# EAGLE design poe-light (EAGLE 6.5.0)
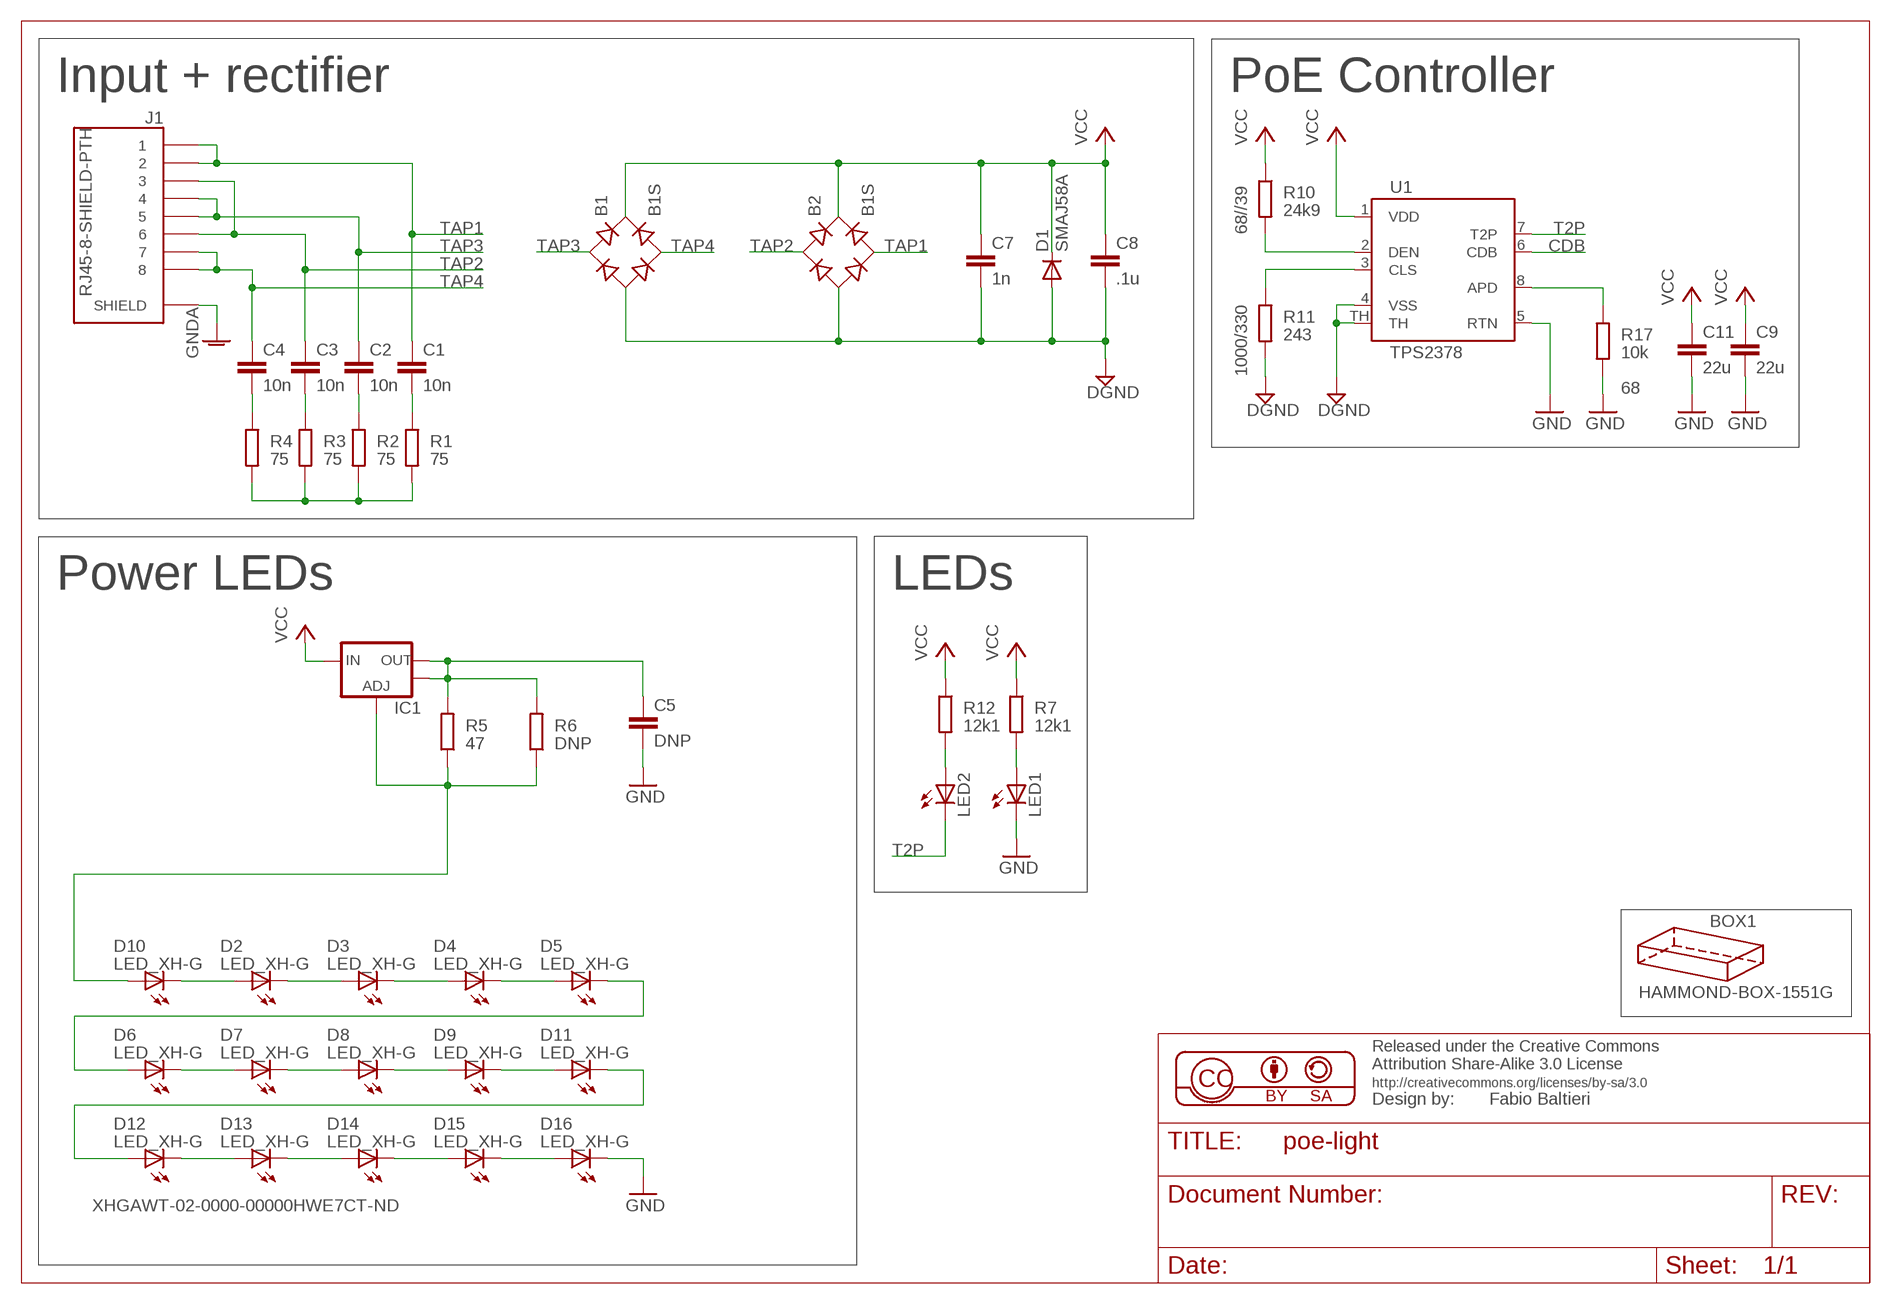
[diagram p0: schematic, sheet 1]

## Parts
B1  B1S  [MBS]
B2  B1S  [MBS]
BOX1  HAMMOND-BOX-1551G  [1551G]
C1  10n  C-EUC0603  [C0603]
C2  10n  C-EUC0603  [C0603]
C3  10n  C-EUC0603  [C0603]
C4  10n  C-EUC0603  [C0603]
C5  DNP  C-EUC0805  [C0805]
C7  1n  C-EUC0603  [C0603]
C8  .1u  C-EUC0603  [C0603]
C9  22u  C-EUC1206  [C1206]
C11  22u  C-EUC1206  [C1206]
D1  SMAJ58A  DIODESMA  [SMA-DIODE]
D2  LED_XH-G  [CREE_XHG]
D3  LED_XH-G  [CREE_XHG]
D4  LED_XH-G  [CREE_XHG]
D5  LED_XH-G  [CREE_XHG]
D6  LED_XH-G  [CREE_XHG]
D7  LED_XH-G  [CREE_XHG]
D8  LED_XH-G  [CREE_XHG]
D9  LED_XH-G  [CREE_XHG]
D10  LED_XH-G  [CREE_XHG]
D11  LED_XH-G  [CREE_XHG]
D12  LED_XH-G  [CREE_XHG]
D13  LED_XH-G  [CREE_XHG]
D14  LED_XH-G  [CREE_XHG]
D15  LED_XH-G  [CREE_XHG]
D16  LED_XH-G  [CREE_XHG]
IC1  V_REG_LM1117SOT223  [SOT223]
J1  RJ45-8-SHIELD-PTH  [RJ45-8-SHIELD]
LED1  LEDSML0805  [SML0805]
LED2  LEDSML0805  [SML0805]
R1  75  R-EU_R0603  [R0603]
R2  75  R-EU_R0603  [R0603]
R3  75  R-EU_R0603  [R0603]
R4  75  R-EU_R0603  [R0603]
R5  47  R-EU_R1206  [R1206]
R6  DNP  R-EU_R1206  [R1206]
R7  12k1  R-EU_R0603  [R0603]
R10  24k9  R-EU_R0603  [R0603]
R11  243  R-EU_R0603  [R0603]
R12  12k1  R-EU_R0603  [R0603]
R17  10k  R-EU_R0603  [R0603]
U1  TPS2378  [SOIC8-POWERPAD]

## Nets
CDB: U1.6(CDB)
DGND: B1.- B2.- C7.2 C8.2 D1.A R11.2 U1.4(VSS) U1.TH
GND: C5.2 C9.2 C11.2 D16.C D16.C@1(C) LED1.C R17.2 U1.5(RTN)
GNDA: J1.P$1(SHIELD) J1.P$2(SHIELD)
N$1: LED1.A R7.2
N$2: LED2.A R12.2
N$3: R10.2 U1.2(DEN)
N$4: R11.1 U1.3(CLS)
N$5: C5.1 IC1.2(OUT) IC1.4(OUT) R5.2 R6.2
N$6: D10.A D10.A@1(A) IC1.1(ADJ) R5.1 R6.1
N$8: D5.C D5.C@1(C) D6.A D6.A@1(A)
N$9: D11.C D11.C@1(C) D12.A D12.A@1(A)
N$10: D2.A D2.A@1(A) D10.C D10.C@1(C)
N$11: D2.C D2.C@1(C) D3.A D3.A@1(A)
N$12: D3.C D3.C@1(C) D4.A D4.A@1(A)
N$13: C4.2 R4.1
N$14: C3.2 R3.1
N$15: C2.2 R2.1
N$16: C1.2 R1.1
N$17: R1.2 R2.2 R3.2 R4.2
N$18: D4.C D4.C@1(C) D5.A D5.A@1(A)
N$19: D6.C D6.C@1(C) D7.A D7.A@1(A)
N$20: D7.C D7.C@1(C) D8.A D8.A@1(A)
N$21: D8.C D8.C@1(C) D9.A D9.A@1(A)
N$22: D9.C D9.C@1(C) D11.A D11.A@1(A)
N$23: D12.C D12.C@1(C) D13.A D13.A@1(A)
N$24: D13.C D13.C@1(C) D14.A D14.A@1(A)
N$25: D14.C D14.C@1(C) D15.A D15.A@1(A)
N$26: D15.C D15.C@1(C) D16.A D16.A@1(A)
N$34: R17.1 U1.8(APD)
T2P: LED2.C U1.7(T2P)
TAP1: B2.AC2 C1.1 J1.1 J1.2
TAP2: B2.AC1 C3.1 J1.3 J1.6
TAP3: B1.AC1 C2.1 J1.4 J1.5
TAP4: B1.AC2 C4.1 J1.7 J1.8
VCC: B1.+ B2.+ C7.1 C8.1 C9.1 C11.1 D1.C IC1.3(IN) R7.1 R10.1 R12.1 U1.1(VDD)

## Notes on the sheet
- Input + rectifier | PoE Controller
- 68//39
- 1000/330
- 68
- Power LEDs | LEDs
- XHGAWT-02-0000-00000HWE7CT-ND

## Library data of the parts
B1 B2 = rectifier:B*S: Surface Mount Glass Passivated Bridge Rectifiers Source: Comchip Bridge Rectifiers B05S-G_B10S-G.pdf
BOX1 = hammond:HAMMOND-BOX: Hammond Project boxes Hammond 1551 Transluscent Blue 50x35x20mm 1551GTBU http://www.hammondmfg.com/pdf/1551G.pdf Hammond 1551 Transluscent Blue 50x50x20mm 1551RTBU http://www.hammondmfg.com/pdf/1551R.pdf Hammond 1551 Transluscent Blue 60x35x20mm 1551HTBU http://www.hammondmfg.com/pdf/1551H.pdf Hammond 1551 Transluscent Blue 80x40x20mm 1551KTBU http://www.hammondmfg.com/pdf/1551K.pdf Hammond 1591 Transluscent Blue 100x51x22m m 1591XXATBU http://www.hammondmfg.com/pdf/1591XXA.pdf
C1-C5 C7-C9 C11 = rcl:C-EU: CAPACITOR, European symbol
D1 = SparkFun-DiscreteSemi:DIODE: Diode These are standard reverse protection diodes and small signal diodes. SMA package can handle up to about 1A. SOD-323 can handle about 200mA. What the SOD-323 package when ordering, there are some mfgs out there that are 5-pin packages.
D2-D16 = balto:LED_XH-G: Cree XLamp XG-H LEDs
IC1 = SparkFun-PowerIC:V_REG_LM1117: Voltage Regulator LM1117 Standard adjustable voltage regulator but in SMD form. Spark Fun Electronics SKU : COM-00595
J1 = balto:RJ45-8-SHIELD
LED1 LED2 = led:LED: LED OSRAM: - CHIPLED LG R971, LG N971, LY N971, LG Q971, LY Q971, LO R971, LY R971 LH N974, LH R974 LS Q976, LO Q976, LY Q976 LO Q996 - Hyper CHIPLED LW Q18S LB Q993, LB Q99A, LB R99A - SideLED LS A670, LO A670, LY A670, LG A670, LP A670 LB A673, LV A673, LT A673, LW A673 LH A674 LY A675 LS A676, LA A676, LO A676, LY A676, LW A676 LS A679, LY A679, LG A679 - Hyper Micro SIDELED® LS Y876, LA Y876, LO Y876, LY Y876 LT Y87S - SmartLED LW L88C, LW L88S LB L89C, LB L89S, LG L890 LS L89K, LO L89K, LY L89K LS L896, LA L896, LO L896, LY L896 - TOPLED LS T670, LO T670, LY T670, LG T670, LP T670 LSG T670, LSP T670, LSY T670, LOP T670, LYG T670 LG T671, LOG T671, LSG T671 LB T673, LV T673, LT T673, LW T673 LH T674 LS T676, LA T676, LO T676, LY T676, LB T676, LH T676, LSB T676, LW T676 LB T67C, LV T67C, LT T67C, LS T67K, LO T67K, LY T67K, LW E67C LS E67B, LA E67B, LO E67B, LY E67B, LB E67C, LV E67C, LT E67C LW T67C LS T679, LY T679, LG T679 LS T770, LO T770, LY T770, LG T770, LP T770 LB T773, LV T773, LT T773, LW T773 LH T774 LS E675, LA E675, LY E675, LS T675 LS T776, LA T776, LO T776, LY T776, LB T776 LHGB T686 LT T68C, LB T68C - Hyper Mini TOPLED® LB M676 - Mini TOPLED Santana® LG M470 LS M47K, LO M47K, LY M47K Source: http://www.osram.convergy.de LUXEON: - LUMILED® LXK2-PW12-R00, LXK2-PW12-S00, LXK2-PW14-U00, LXK2-PW14-V00 LXK2-PM12-R00, LXK2-PM12-S00, LXK2-PM14-U00 LXK2-PE12-Q00, LXK2-PE12-R00, LXK2-PE12-S00, LXK2-PE14-T00, LXK2-PE14-U00 LXK2-PB12-K00, LXK2-PB12-L00, LXK2-PB12-M00, LXK2-PB14-N00, LXK2-PB14-P00, LXK2-PB14-Q00 LXK2-PR12-L00, LXK2-PR12-M00, LXK2-PR14-Q00, LXK2-PR14-R00 LXK2-PD12-Q00, LXK2-PD12-R00, LXK2-PD12-S00 LXK2-PH12-R00, LXK2-PH12-S00 LXK2-PL12-P00, LXK2-PL12-Q00, LXK2-PL12-R00 Source: www.luxeon.com KINGBRIGHT: KA-3528ASYC Source: www.kingbright.com
R1-R7 R10-R12 R17 = rcl:R-EU_: RESISTOR, European symbol
U1 = balto:TPS2378: IEEE 802.3at PoE High-Power PD Interface

## Board
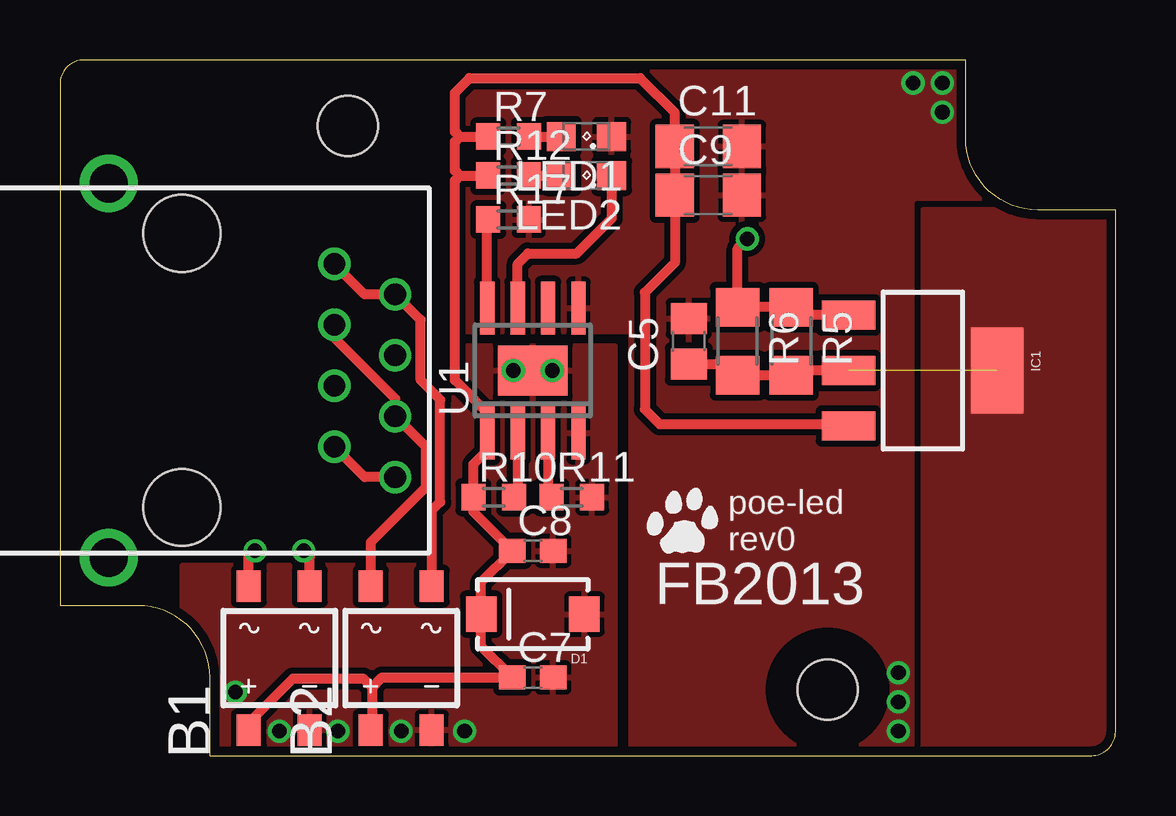
[diagram p1: board, top side]
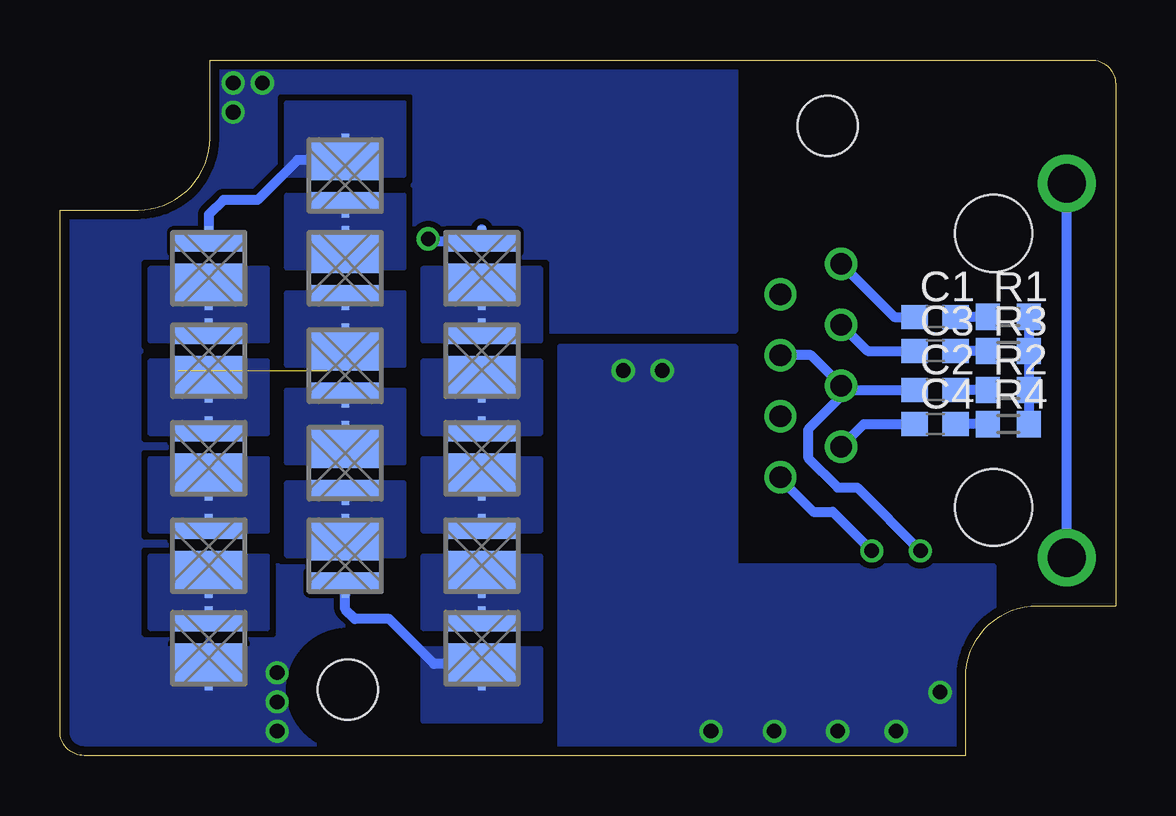
[diagram p2: board, bottom side, seen from below]

Size 44 x 29 mm. Coordinates in mm from the lower left corner, seen from the top.
Copper layers (1*16): Top 0.035mm / dielectric 1.5mm / Bottom 0.035mm
Design rules "balto *": minimum track width 6mil, minimum drill 13mil, track to track 6mil, track to pad 6mil, pad to pad 6mil, via to via 6mil, smd to smd 6mil, copper to edge 15mil, drill to drill 6mil, minimum pad ring 7mil, minimum via ring 7mil, stop-mask expansion 2mil, vias tented up to drill 24mil, thermal gap 8mil

### Footprints (pad centres in the part's own frame; a part is rotated, then mirrored left to right if it is on the bottom)
MBS = smd 1 x 1.3: + -1.27,-3; - 1.27,-3; AC1 -1.27,3; AC2 1.27,3
1551G = hole 2.5: 32,2.75; 12,26.25
C0603 = smd 1.1 x 1: 1 -0.85,0; 2 0.85,0
C0805 = smd 1.3 x 1.5: 1 -0.95,0; 2 0.95,0
C1206 = smd 1.6 x 1.8: 1 -1.4,0; 2 1.4,0
SMA-DIODE = smd 1.27 x 1.47: A -2.15,0; C 2.15,0
CREE_XHG = smd 0.8 x 3: A 1.1,0 | smd 0.25 x 0.33: A@1 1.625,0; C@1 -1.625,0 | smd 1.7 x 3: C -0.65,0
SOT223 = smd 1.219 x 2.235: 1 -2.311,-3.099; 2 0,-3.099; 3 2.311,-3.099 | smd 3.6 x 2.2: 4 0,3.099
RJ45-8-SHIELD = drill 0.9: 1 -4.445,6.35; 2 -3.175,8.89; 3 -1.905,6.35; 4 -0.635,8.89; 5 0.635,6.35; 6 1.905,8.89; 7 3.175,6.35; 8 4.445,8.89 | drill 1.6: P$1 7.795,-3.05; P$2 -7.795,-3.05 | hole 3.2: -5.715,0; 5.715,0
SML0805 = smd 1.2 x 1.2: A 1.05,0; C -1.05,0
R0603 = smd 1 x 1.1: 1 -0.85,0; 2 0.85,0
R1206 = smd 1.6 x 1.803: 1 -1.422,0; 2 1.422,0
SOIC8-POWERPAD = smd 0.6 x 2.2: 1 -1.905,-2.6; 2 -0.635,-2.6; 3 0.635,-2.6; 4 1.905,-2.6; 5 1.905,2.6; 6 0.635,2.6; 7 -0.635,2.6; 8 -1.905,2.6 | smd 2.9 x 2.1: TH 0,0

### Placement (x,y rotation side)
B1  9.14,4.06 0 top
B2  14.22,4.06 0 top
BOX1  0,0 0 top
C1  7.52,18.29 0 bottom
C2  7.52,15.24 0 bottom
C3  7.52,16.87 0 bottom
C4  7.52,13.82 0 bottom
C5  26.21,17.27 90 top
C7  19.71,3.25 0 top
C8  19.71,8.53 0 top
C9  27.03,23.37 0 top
C11  27.03,25.4 0 top
D1  19.71,5.89 180 top
D2  26.42,16.46 90 bottom
D3  26.42,12.4 90 bottom
D4  26.42,8.33 90 bottom
D5  26.42,4.47 90 bottom
D6  32.11,8.33 270 bottom
D7  32.11,12.19 270 bottom
D8  32.11,16.26 270 bottom
D9  32.11,20.32 270 bottom
D10  26.42,20.32 90 bottom
D11  32.11,24.18 270 bottom
D12  37.8,20.32 90 bottom
D13  37.8,16.46 90 bottom
D14  37.8,12.4 90 bottom
D15  37.8,8.33 90 bottom
D16  37.8,4.47 90 bottom
IC1  35.97,16.05 270 top
J1  5.08,16.05 270 top
LED1  21.95,25.81 180 top
LED2  21.95,24.18 180 top
R1  4.47,18.29 0 bottom
R2  4.47,15.24 0 bottom
R3  4.47,16.87 0 bottom
R4  4.47,13.82 0 bottom
R5  30.48,17.27 270 top
R6  28.24,17.27 270 top
R7  18.69,25.81 0 top
R10  18.08,10.77 0 top
R11  21.34,10.77 0 top
R12  18.69,24.18 0 top
R17  18.69,22.35 0 top
U1  19.71,16.05 0 top
U$1  [CAT-L]  26.01,9.35 0 top

### Tracks (layer width: path | path; a pad name or v marks a point on that pad's centre or on a via)
DGND  (via drill 0.61)
  other vias: 14.22,1.02 18.9,16.05 20.52,16.05 9.14,1.02 11.58,1.02 16.87,1.02 7.32,2.64
  pour Top (isolate 0.254): 5.08,-0.61 23.16,-0.61 23.16,17.07 15.85,17.07 15.85,7.92 5.08,7.92
  pour Bottom (isolate 0.254): 5.08,-0.61 23.16,-0.61 23.16,17.07 15.85,17.07 15.85,7.92 5.08,7.92
GND  (via drill 0.61)
  other vias: 34.95,1.02 34.95,2.24 34.95,3.45 36.78,28.04 35.56,28.04 36.78,26.82
  pour Top (isolate 0.254, rank 2): 23.77,-0.61 44.7,-0.61 44.7,29.46 15.85,29.46 15.85,17.68 23.77,17.68
  pour Bottom (isolate 0.254, rank 2): 23.77,-0.61 44.7,-0.61 44.7,29.46 15.85,29.46 15.85,17.68 23.77,17.68
  pour Bottom (no thermals): 35.36,1.42 40.23,1.42 40.23,4.47 35.36,4.47
GNDA
  Bottom 0.406: J1.P$1 J1.P$2
N$1
  Top 0.406: R7.2 LED1.A
N$2
  Top 0.406: R12.2 LED2.A
N$3
  Top 0.406: U1.2 19.07,10.91 R10.2
N$4
  Top 0.406: U1.3 20.34,10.91 R11.1
N$5  (1 unrouted)
  Top 0.406: IC1.2 30.68,16.05 R5.2 R6.2 27.77,16.32 C5.1
  pour Top (isolate 0.254, no thermals): 35.97,0 44.09,0 44.09,22.76 35.97,22.76
N$6  (via drill 0.61)
  Top 0.406: IC1.1 30.81,18.36 R5.1 R6.1 28.25,21.13 v28.65,21.54
  Bottom 0.406: D10.A@1 D10.A 28.53,21.42 v28.65,21.54
N$8
  Bottom 0.406: D5.C 28.41,3.82 30.28,5.69 31.7,5.69 32.11,6.1 D6.A@1 D6.A
  pour Bottom (no thermals): 23.98,1.42 28.85,1.42 28.85,4.47 23.98,4.47
N$9
  Bottom 0.406: D11.C 34.1,24.83 35.76,23.16 37.19,23.16 37.8,22.55 D12.A@1 D12.A
  pour Bottom (no thermals): 29.67,24.18 34.54,24.18 34.54,27.23 29.67,27.23
N$10
  pour Bottom (no thermals): 23.98,17.27 28.85,17.27 28.85,20.32 23.98,20.32
N$11
  pour Bottom (no thermals): 23.98,13.41 28.85,13.41 28.85,16.46 23.98,16.46
N$12
  pour Bottom (no thermals): 23.98,9.35 28.85,9.35 28.85,12.4 23.98,12.4
N$13
  Bottom 0.406: R4.1 C4.2
N$14
  Bottom 0.406: R3.1 C3.2
N$15
  Bottom 0.406: R2.1 C2.2
N$16
  Bottom 0.406: R1.1 C1.2
N$17
  Bottom 0.406: R1.2 R3.2 R2.2 R4.2
N$18
  pour Bottom (no thermals): 23.98,5.28 28.85,5.28 28.85,8.33 23.98,8.33
N$19
  pour Bottom (no thermals): 29.67,8.33 34.54,8.33 34.54,11.38 29.67,11.38
N$20
  pour Bottom (no thermals): 29.67,12.19 34.54,12.19 34.54,15.24 29.67,15.24
N$21
  pour Bottom (no thermals): 29.67,16.26 34.54,16.26 34.54,19.3 29.67,19.3
N$22
  pour Bottom (no thermals): 29.67,20.32 34.54,20.32 34.54,23.37 29.67,23.37
N$23
  pour Bottom (no thermals): 35.36,17.27 40.23,17.27 40.23,20.32 35.36,20.32
N$24
  pour Bottom (no thermals): 35.36,13.41 40.23,13.41 40.23,16.46 35.36,16.46
N$25
  pour Bottom (no thermals): 35.36,9.35 40.23,9.35 40.23,12.4 35.36,12.4
N$26
  pour Bottom (no thermals): 35.36,5.28 40.23,5.28 40.23,8.33 35.36,8.33
N$34
  Top 0.406: U1.8 17.8,22.31 R17.1
T2P
  Top 0.406: U1.7 19.07,20.5 19.51,20.93 21.54,20.93 23,22.39 LED2.C
TAP1
  Top 0.406: J1.1 12.7,19.23 J1.2 15.04,18.16 15.04,15.65 15.85,14.83 15.85,10.57 15.49,10.21 B2.AC2
  Bottom 0.406: J1.1 9.22,18.29 C1.1
TAP2
  Top 0.406: J1.3 11.43,17.42 13.97,14.88 J1.6 15.24,12.88 15.24,11.18 12.95,8.89 B2.AC1
  Bottom 0.406: J1.3 10.34,16.87 C3.1
TAP3  (via drill 0.6)
  Top 0.406: B1.AC1 7.87,8.28 v8.13,8.53
  Bottom 0.406: J1.5 11.43,14.99 12.8,13.61 12.8,12.39 11.58,11.18 10.77,11.18 v8.13,8.53 | J1.5 12.7,16.69 J1.4 | J1.5 11.25,15.24 C2.1
TAP4  (via drill 0.6)
  Top 0.406: J1.8 12.7,11.61 J1.7 | B1.AC2 10.41,8.28 v10.16,8.53
  Bottom 0.406: J1.8 13.97,11.53 12.6,10.16 11.79,10.16 v10.16,8.53 | J1.7 10.49,13.82 C4.1
VCC
  Top 0.406: 18.86,3.21 C7.1 | C7.1 17.56,4.55 D1.C 17.56,7.23 C8.1 17.23,10.16 R10.1 17.23,12.15 17.8,12.72 U1.1 17.8,14.3 16.46,15.65 16.46,23.98 16.66,24.18 | 16.66,24.18 16.46,24.38 16.46,25.6 16.66,25.81 | 16.66,25.81 16.46,26.01 16.46,27.64 17.07,28.25 24.18,28.25 25.63,26.8 C11.1 C9.1 25.63,20.55 24.38,19.3 24.38,14.43 24.99,13.82 32.79,13.82 IC1.3 | 16.66,24.18 R12.1 | 16.66,25.81 R7.1 | B1.+ 7.87,1.37 9.72,3.21 12.64,3.21 13.01,2.85 | 13.01,2.85 13.41,3.25 C7.1 | 13.01,2.85 13.01,1.11 B2.+

### Text on the board
_tsilk: poe-led / rev0 | FB2013